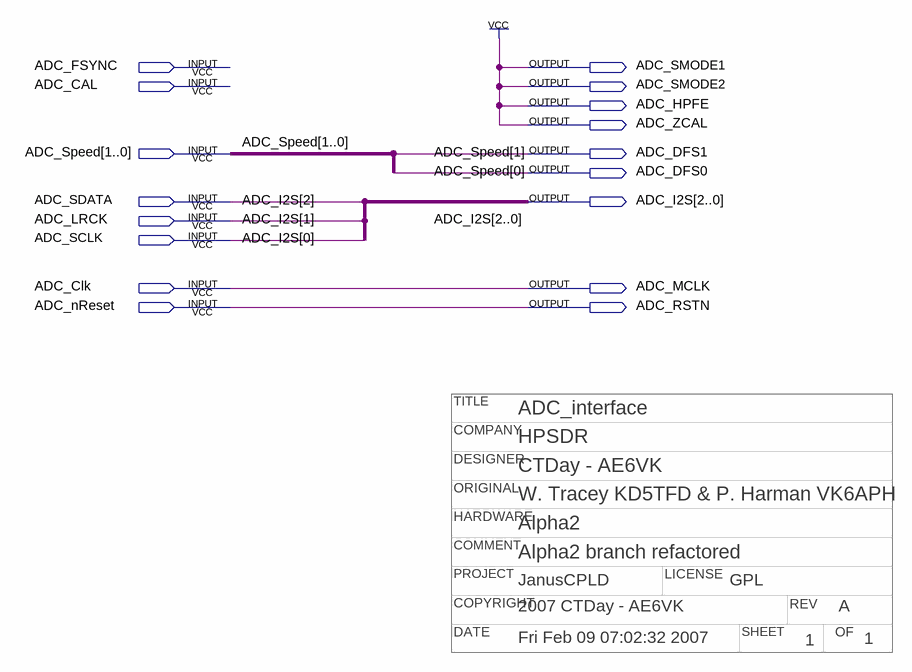
[diagram p0: schematic sheet]
// Quartus schematic ADC_interface.bdf as structural Verilog: 0 symbols, 17 pins
// Title block: TITLE: ADC_interface; COMPANY: HPSDR; DESIGNER: CTDay - AE6VK; COPYRIGHT: 2007 CTDay - AE6VK; REV: A; DATE: Fri Feb 09 07:02:32 2007; SHEET: 1; OF: 1; ORIGINAL: W. Tracey KD5TFD & P. Harman VK6APH; HARDWARE: Alpha2; COMMENT: Alpha2 branch refactored; PROJECT: JanusCPLD; LICENSE: GPL
module ADC_interface (
  input  ADC_FSYNC,
  input  ADC_CAL,
  input  [1:0] ADC_Speed,
  input  ADC_SDATA,
  input  ADC_LRCK,
  input  ADC_SCLK,
  input  ADC_Clk,
  input  ADC_nReset,
  output ADC_SMODE1,
  output ADC_SMODE2,
  output ADC_HPFE,
  output ADC_ZCAL,
  output ADC_DFS1,
  output ADC_DFS0,
  output [2:0] ADC_I2S,
  output ADC_MCLK,
  output ADC_RSTN
);


  assign ADC_DFS0 = ADC_Speed[0];
  assign ADC_DFS1 = ADC_Speed[1];
  assign ADC_HPFE = 1'b1;
  assign ADC_I2S = {ADC_SDATA, ADC_LRCK, ADC_SCLK};
  assign ADC_MCLK = ADC_Clk;
  assign ADC_RSTN = ADC_nReset;
  assign ADC_SMODE1 = 1'b1;
  assign ADC_SMODE2 = 1'b1;
  assign ADC_ZCAL = 1'b1;
endmodule
